# EAGLE design Servo_Tester (EAGLE 9.7.0)
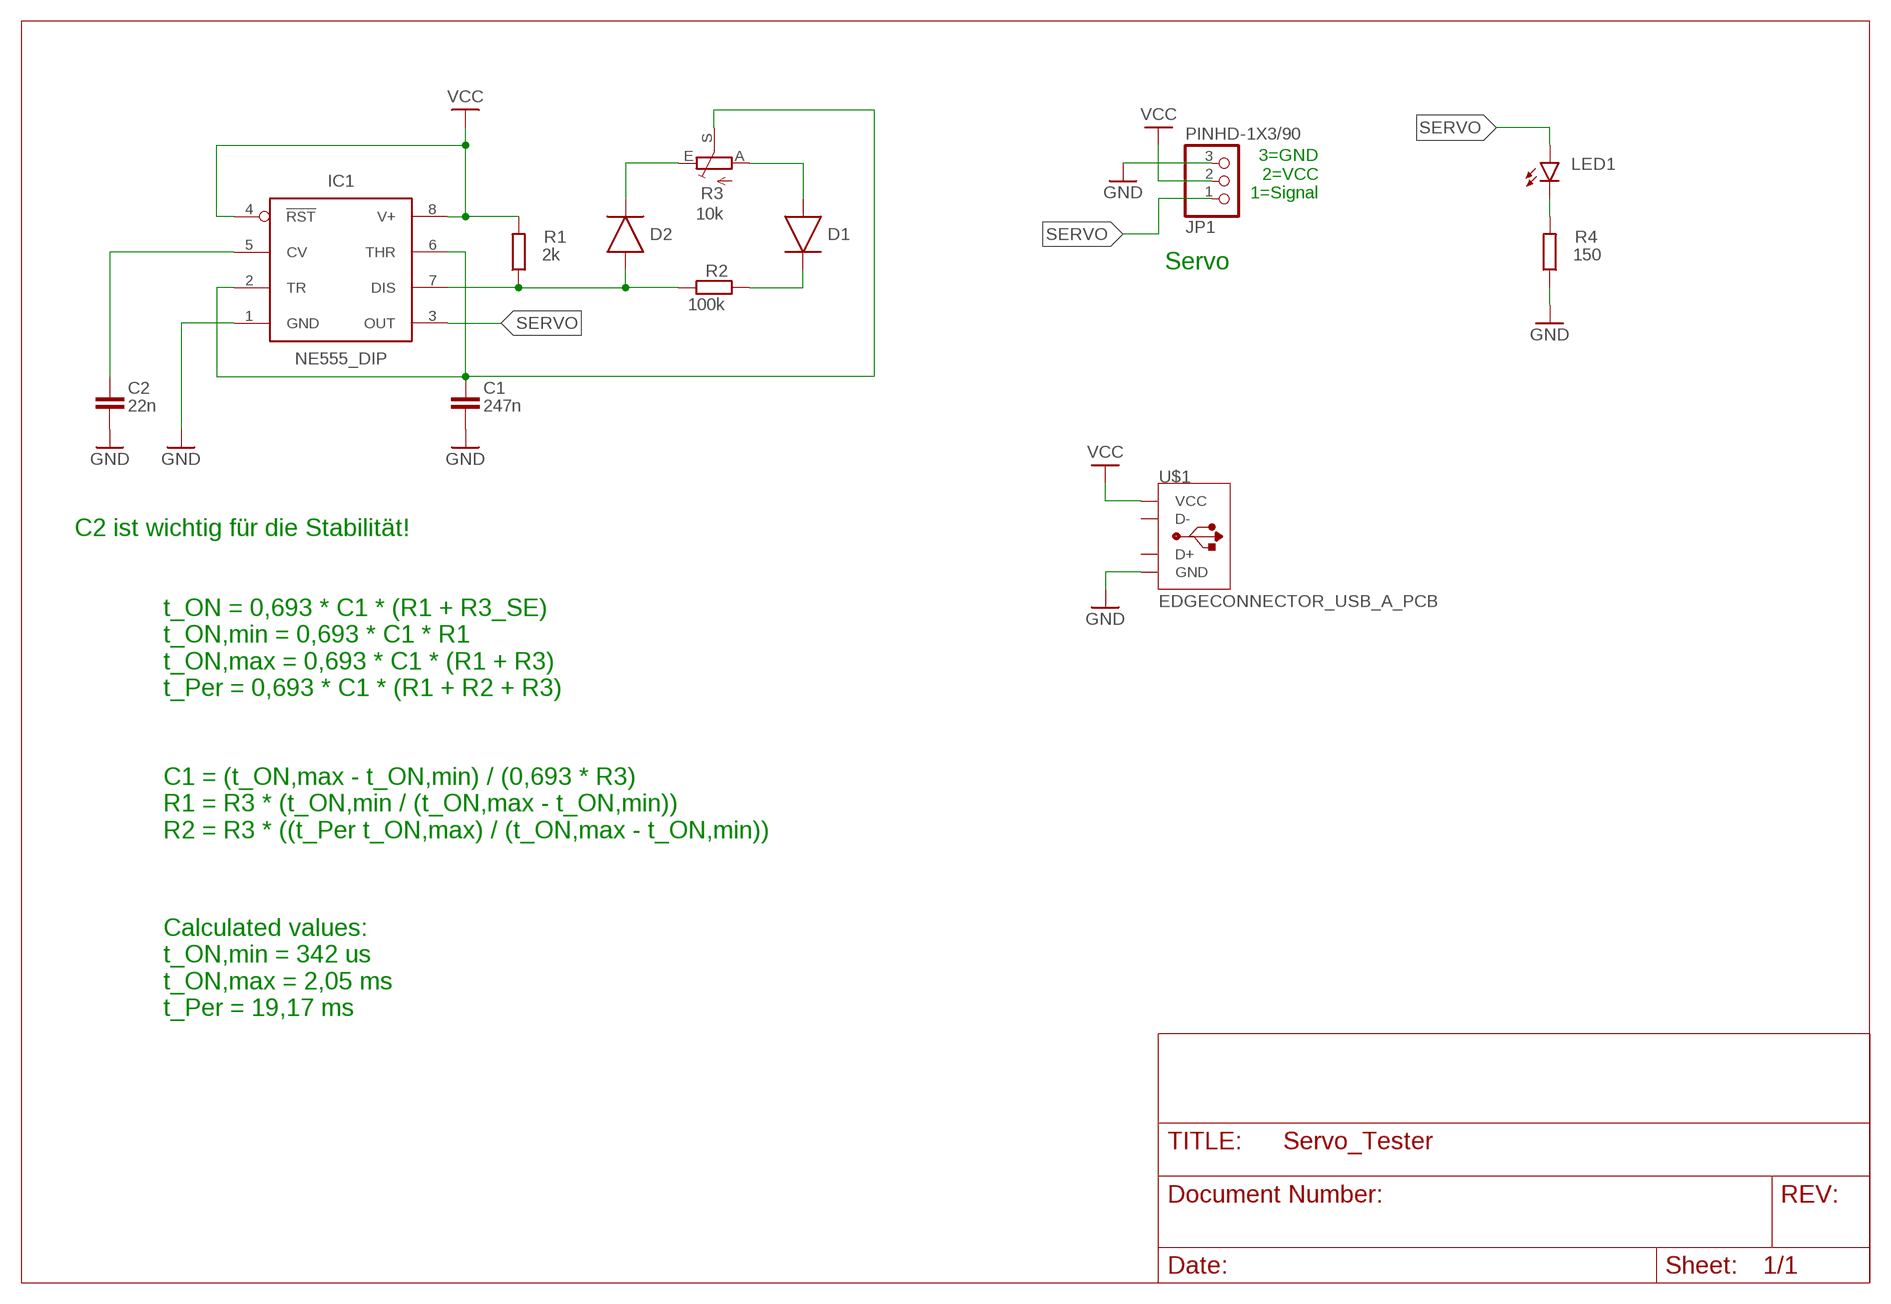
[diagram p0: schematic, sheet 1]

## Parts
C1  247n  C_CHIP-0805(2012-METRIC)  [CAPC2012X110]
C2  22n  C_CHIP-0805(2012-METRIC)  [CAPC2012X110]
D1  DIODE_LL4148_SOD-80  [DIOMELF3516]
D2  DIODE_LL4148_SOD-80  [DIOMELF3516]
IC1  NE555_DIP  ICM7555_DIP  [DIP826W53P254L959H508Q8B]
JP1  PINHD-1X3/90  [1X03/90]
LED1  LEDCHIP-LED0805  [CHIP-LED0805]
R1  2k  R-EU_R0805  [R0805]
R2  100k  R-EU_R0805  [R0805]
R3  10k  TRIM_EU-LI15  [LI15]
R4  150  R-EU_R0805  [R0805]
U$1  EDGECONNECTOR_USB_A_PCB  [EDGECONNECTOR_USB_A_PCB]

## Nets
GND: C1.2 C2.2 IC1.1(GND) JP1.3 R4.1 U$1.GND
N$1: C2.1 IC1.5(CV)
N$2: C1.1 IC1.2(TR) IC1.6(THR) R3.S
N$3: D2.2(A) IC1.7(DIS) R1.1 R2.1
N$4: D1.1(C) R2.2
N$5: D2.1(C) R3.E
N$6: D1.2(A) R3.A
N$7: LED1.C R4.2
SERVO: IC1.3(OUT) JP1.1 LED1.A
VCC: IC1.4(!RST) IC1.8(V+) JP1.2 R1.2 U$1.VCC
Unconnected: U$1.D+ U$1.D-

## Notes on the sheet
- 3=GND
  2=VCC
  1=Signal
- Servo
- C2 ist wichtig für die Stabilität!
- t_ON = 0,693 * C1 * (R1 + R3_SE)
  t_ON,min = 0,693 * C1 * R1
  t_ON,max = 0,693 * C1 * (R1 + R3)
  t_Per = 0,693 * C1 * (R1 + R2 + R3)
- C1 = (t_ON,max - t_ON,min) / (0,693 * R3)
  R1 = R3 * (t_ON,min / (t_ON,max - t_ON,min))
  R2 = R3 * ((t_Per t_ON,max) / (t_ON,max - t_ON,min))
- Calculated values:
  t_ON,min = 342 us
  t_ON,max = 2,05 ms
  t_Per = 19,17 ms

## Library data of the parts
C1 C2 = Capacitor:C: Capacitor - Generic; CATEGORY: Capacitor
D1 D2 = Diode:DIODE_: Diode Rectifier - Popular parts; CATEGORY: Diode; DESCRIPTION: DIODE GEN PURP 100V 200MA SOD80; MANUFACTURER: ON Semiconductor; SUB-CATEGORY: Rectifier; VALUE: LL4148
IC1 = IC_Clock-Timing:*555: TIMER 555 General purpose precision timers NE555 : Texas Datasheet <http://www.ti.com/general/docs/suppproductinfo.tsp?distId=10&gotoUrl=http%3A%2F%2Fwww.ti.com%2Flit%2Fgpn%2Fne555>, Diodes Incorporated Datasheet <https://www.diodes.com/assets/Datasheets/NE555_SA555_NA555.pdf> LM555 Datasheet <http://www.ti.com/general/docs/suppproductinfo.tsp?distId=10&gotoUrl=http%3A%2F%2Fwww.ti.com%2Flit%2Fgpn%2Flm555> LMC555 Datasheet <http://www.ti.com/general/docs/suppproductinfo.tsp?distId=10&gotoUrl=http%3A%2F%2Fwww.ti.com%2Flit%2Fgpn%2Flmc555> ICM7555 : Maxim Integrated Datasheet <https://datasheets.maximintegrated.com/en/ds/ICM7555-ICM7556.pdf>, Renesas Electronics America Inc Datasheet <https://www.renesas.com/en-us/www/doc/datasheet/icm7555-56.pdf>; CATEGORY: IC_Clock-Timing; CURRENT-SUPPLY: 60µA; DESCRIPTION: IC OSC SINGLE TIMER 1MHZ 8DIP; FREQUENCY: 1MHz; MANUFACTURER: Renesas Electronics America Inc; MPN: ICM7555IPAZ; OPERATING_TEMP: -25°C to 85°C; PART_STATUS: Active; ROHS_COMPLIANT: ROHS3 Compliant; SUB-CATEGORY: Timer
JP1 = Connector:PINHD-1X3: PIN HEADER; CATEGORY: Headers; DESCRIPTION: Header, Right Angle, 3 Position; MANUFACTURER: Generic; MPN: Generic; OPERATING_TEMPERATURE: Generic; PART_STATUS: Active; PITCH: 0.100" (2.54mm); ROHS_COMPLIANCE: Generic; SERIES: Generic; SUB-CATEGORY: Headers, Male Pins; TYPE: Board to Board or Cable, Unshrouded, Through Hole, Right Angle
LED1 = OwnDevices:LED: LED OSRAM: - CHIPLED LG R971, LG N971, LY N971, LG Q971, LY Q971, LO R971, LY R971 LH N974, LH R974 LS Q976, LO Q976, LY Q976 LO Q996 - Hyper CHIPLED LW Q18S LB Q993, LB Q99A, LB R99A - SideLED LS A670, LO A670, LY A670, LG A670, LP A670 LB A673, LV A673, LT A673, LW A673 LH A674 LY A675 LS A676, LA A676, LO A676, LY A676, LW A676 LS A679, LY A679, LG A679 - Hyper Micro SIDELED® LS Y876, LA Y876, LO Y876, LY Y876 LT Y87S - SmartLED LW L88C, LW L88S LB L89C, LB L89S, LG L890 LS L89K, LO L89K, LY L89K LS L896, LA L896, LO L896, LY L896 - TOPLED LS T670, LO T670, LY T670, LG T670, LP T670 LSG T670, LSP T670, LSY T670, LOP T670, LYG T670 LG T671, LOG T671, LSG T671 LB T673, LV T673, LT T673, LW T673 LH T674 LS T676, LA T676, LO T676, LY T676, LB T676, LH T676, LSB T676, LW T676 LB T67C, LV T67C, LT T67C, LS T67K, LO T67K, LY T67K, LW E67C LS E67B, LA E67B, LO E67B, LY E67B, LB E67C, LV E67C, LT E67C LW T67C LS T679, LY T679, LG T679 LS T770, LO T770, LY T770, LG T770, LP T770 LB T773, LV T773, LT T773, LW T773 LH T774 LS E675, LA E675, LY E675, LS T675 LS T776, LA T776, LO T776, LY T776, LB T776 LHGB T686 LT T68C, LB T68C - Hyper Mini TOPLED® LB M676 - Mini TOPLED Santana® LG M470 LS M47K, LO M47K, LY M47K Source: http://www.osram.convergy.de LUXEON: - LUMILED® LXK2-PW12-R00, LXK2-PW12-S00, LXK2-PW14-U00, LXK2-PW14-V00 LXK2-PM12-R00, LXK2-PM12-S00, LXK2-PM14-U00 LXK2-PE12-Q00, LXK2-PE12-R00, LXK2-PE12-S00, LXK2-PE14-T00, LXK2-PE14-U00 LXK2-PB12-K00, LXK2-PB12-L00, LXK2-PB12-M00, LXK2-PB14-N00, LXK2-PB14-P00, LXK2-PB14-Q00 LXK2-PR12-L00, LXK2-PR12-M00, LXK2-PR14-Q00, LXK2-PR14-R00 LXK2-PD12-Q00, LXK2-PD12-R00, LXK2-PD12-S00 LXK2-PH12-R00, LXK2-PH12-S00 LXK2-PL12-P00, LXK2-PL12-Q00, LXK2-PL12-R00 Source: www.luxeon.com KINGBRIGHT: KA-3528ASYC Source: www.kingbright.com
R1 R2 R4 = OwnDevices:R-EU_: RESISTOR, European symbol; SPICEPREFIX: R
R3 = pot:TRIM_EU-: POTENTIOMETER
U$1 = OwnDevices:EDGECONNECTOR_USB_A_PCB

## Board
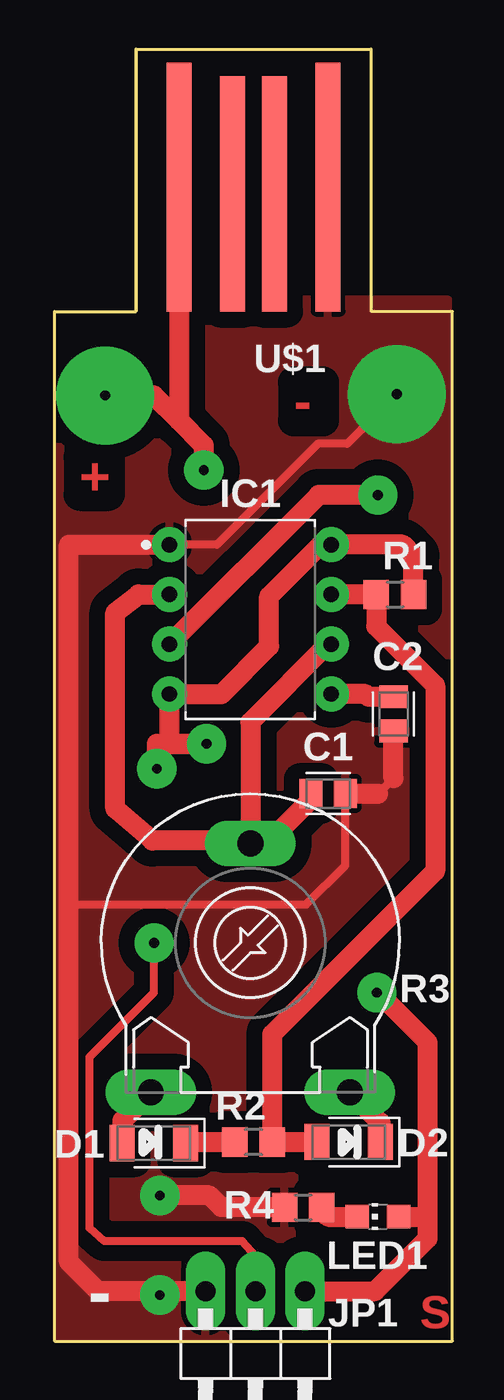
[diagram p1: board, top side]
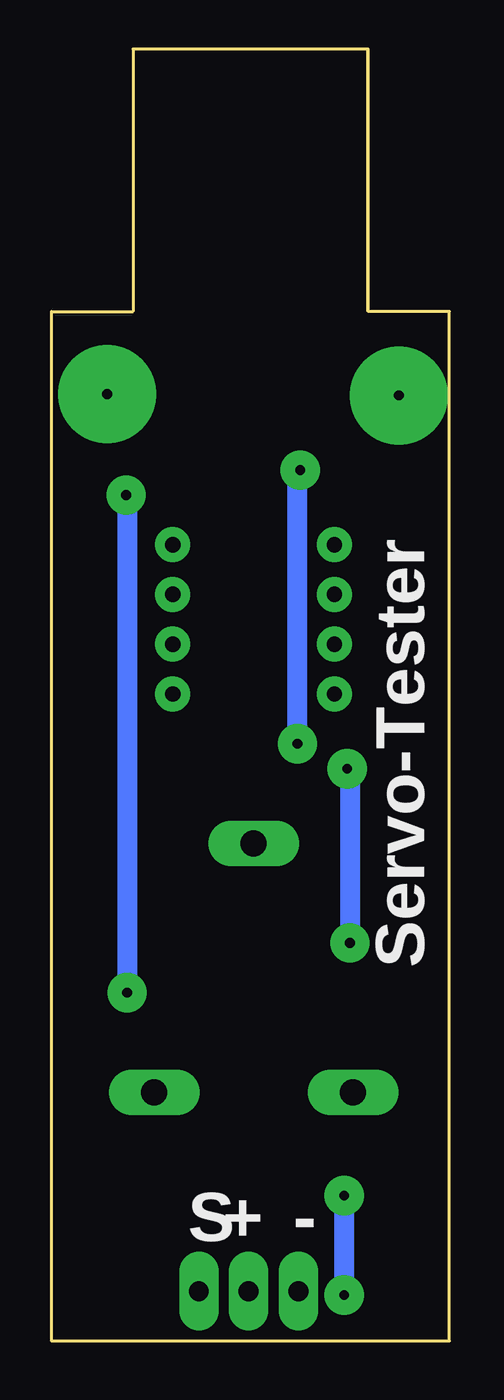
[diagram p2: board, bottom side, seen from below]

Size 20.32 x 65.94 mm. Coordinates in mm from the lower left corner, seen from the top.
Outline: 0,0 20.32,0 20.32,52.54 16.16,52.54 16.16,65.93 4.16,65.93 4.16,52.54 0,52.54 0,0
Copper layers (1*16): Top 0.035mm / dielectric 1.5mm / Bottom 0.035mm
Design rules "ownDesignRules2": minimum track width 0.4mm, minimum drill 0.5mm, track to track 0.35mm, track to pad 0.25mm, pad to pad 6mil, via to via 6mil, smd to smd 6mil, copper to edge 0mil, drill to drill 6mil, minimum pad ring 0.5mm, minimum via ring 8mil, stop-mask expansion 4mil, vias tented up to drill 0mil, thermal gap 10mil

### Footprints (pad centres in the part's own frame; a part is rotated, then mirrored left to right if it is on the bottom)
CAPC2012X110 = smd 1.165 x 1.465: 1 -0.875,0; 2 0.875,0
DIOMELF3516 = smd 1.275 x 1.85: 1 -1.62,0; 2 1.62,0
DIP826W53P254L959H508Q8B = drill 0.786 pad 1.386: 1 -4.13,3.81; 2 -4.13,1.27; 3 -4.13,-1.27; 4 -4.13,-3.81; 5 4.13,-3.81; 6 4.13,-1.27; 7 4.13,1.27; 8 4.13,3.81
1X03/90 = drill 1.016 long: 1 -2.54,-3.81; 2 0,-3.81; 3 2.54,-3.81
CHIP-LED0805 = smd 1.2 x 1.2: A 0,-1.05; C 0,1.05
R0805 = smd 1.3 x 1.5: 1 -0.95,0; 2 0.95,0
LI15 = drill 1.321 long: A -5.08,-7.62; E 5.08,-7.62; S 0,5.08
EDGECONNECTOR_USB_A_PCB = smd 1.27 x 12: D+ 1.08,-7.4; D- -1.08,-7.4 | smd 1.27 x 12.7: GND 3.81,-7.05; VCC -3.81,-7.05

### Placement (x,y rotation side)
C1  13.97,27.94 0 top
C2  17.31,32 270 top
D1  5.08,10.1 180 top
D2  15.02,10.16 180 top
IC1  10,36.83 0 top
JP1  10.26,-1.27 180 top
LED1  16.51,6.35 90 top
R1  17.38,38.1 0 top
R2  10.16,10.16 180 top
R3  10,20.32 0 top
R4  12.7,6.83 0 top
U$1  10.16,65.94 0 top

### Tracks (layer width: path | path; a pad name or v marks a point on that pad's centre or on a via)
GND  (via drill 0.5 pad 2, 0.5 pad 5)
  Top 0.4: v17.49,48.33 14.95,45.79 13.44,45.79 8.29,40.64 IC1.1 | 16.53,27.94 17.31,28.71 | 0.73,22.27 12.85,22.27 14.85,24.27 C1.2
  Top 1.016: IC1.1 0.73,40.64 0.73,22.27 0.73,4.04 2.23,2.54 JP1.3 | 17.31,28.71 C2.2 | C1.2 16.53,27.94 | R4.1 8.52,6.83 7.92,7.43 v5.38,7.43
  Bottom 1.016: v5.38,7.43 v5.38,2.35
  pour Top (isolate 0.813): 0.2,0.2 20.12,0.2 20.12,53.14 0.2,53.14
N$1
  Top 1.016: IC1.5 15.9,33.02 16.04,32.88 C2.1
N$2
  Top 0.4: 10,25.54 R3.S
  Top 1.016: 10,25.54 11,25.54 13,27.54 C1.1 | IC1.2 4.29,38.1 3.1,37.18 3.1,27.17 5,25.54 10,25.54 | IC1.6 13.97,35.56 10,31.59 10,25.54
N$3
  Top 1.016: D2.2 R2.1 11.11,15.66 19.43,23.98 19.43,33.47 16.43,36.47 R1.1 IC1.7
N$4
  Top 0.4: 6.76,10.16 D1.1
  Top 1.016: 6.76,10.16 R2.2
N$5
  Top 1.016: D2.1 16.64,11.14 R3.E
N$6
  Top 1.016: D1.2 3.46,11.24 R3.A
N$7
  Top 1.016: R4.2 13.65,6.67 13.97,6.35 LED1.C
SERVO  (via drill 0.5 pad 2)
  Top 0.406: 16.51,17.78 v16.46,17.78
  Top 1.016: v16.51,43.18 13.49,43.18 IC1.3 | 16.51,17.78 19.05,15.24 19.05,6.35 | JP1.1 16.36,2.54 19.05,5.23 19.05,6.35 | LED1.A 19.05,6.35
  Bottom 0.406: 16.46,43.18 16.51,43.13 v16.51,43.18
  Bottom 1.016: 16.46,43.18 v16.46,17.78
VCC  (via drill 0.5 pad 2, 0.5 pad 5)
  Top 0.406: v5.08,20.32 5.08,17.78 1.79,14.49 1.79,5.75 2.54,5.1 9.59,5.1 10.26,4.34 JP1.2
  Top 1.016: R1.2 18.33,40.09 17.78,40.64 IC1.8 13.6,40.64 10.96,38 10.96,35.46 8.52,33.02 IC1.4 5.87,30.48 v7.76,30.48 5.22,30.48 v5.22,29.21 | v7.62,44.45 7.62,45.72 6.35,46.99 | 6.35,46.99 5.08,48.26 v2.58,48.26 | U$1.VCC 6.35,46.99
  Bottom 0.406: v5.22,29.21 5.08,29.07 | 7.76,44.31 v7.62,44.45
  Bottom 1.016: 5.08,29.07 v5.08,20.32 | v7.76,30.48 7.76,44.31

### Text on the board
Top: - | + | S
tNames: -
bNames: Servo-Tester | - | + | S